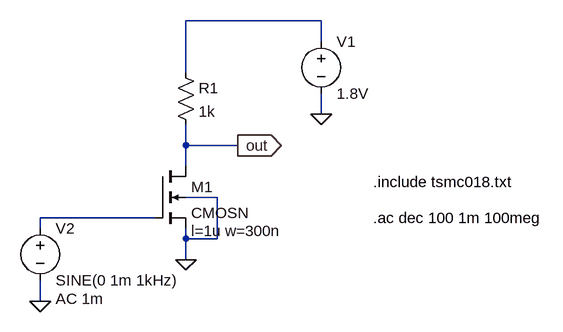
[diagram p0: schematic NMOS.asc]
NMOS.asc, the LTspice schematic file:
Version 4
SHEET 1 880 680
WIRE 464 -128 256 -128
WIRE 464 -96 464 -128
WIRE 256 -48 256 -128
WIRE 464 16 464 -16
WIRE 256 64 256 32
WIRE 336 64 256 64
WIRE 256 96 256 64
WIRE 304 144 256 144
WIRE 208 176 32 176
WIRE 32 192 32 176
WIRE 256 208 256 192
WIRE 304 208 304 144
WIRE 304 208 256 208
WIRE 256 240 256 208
WIRE 32 304 32 272
FLAG 256 240 0
FLAG 464 16 0
FLAG 32 304 0
FLAG 336 64 out
IOPIN 336 64 Out
SYMBOL nmos4 208 96 R0
WINDOW 123 56 100 Left 2
SYMATTR Value2 l=1u w=300n
SYMATTR InstName M1
SYMATTR Value CMOSN
SYMBOL voltage 464 -112 R0
WINDOW 123 0 0 Left 0
WINDOW 39 0 0 Left 0
SYMATTR InstName V1
SYMATTR Value 1.8V
SYMBOL voltage 32 176 R0
WINDOW 123 24 124 Left 2
WINDOW 39 0 0 Left 0
SYMATTR Value2 AC 1m
SYMATTR InstName V2
SYMATTR Value SINE(0 1m 1kHz)
SYMBOL res 240 -64 R0
SYMATTR InstName R1
SYMATTR Value 1k
TEXT 544 120 Left 2 !.include tsmc018.txt
TEXT 544 176 Left 2 !.ac dec 100 1m 100meg

The netlist it stands for:
* NMOS.asc
M1 out N002 0 0 CMOSN l=1u w=300n
V1 N001 0 1.8V
V2 N002 0 SINE(0 1m 1kHz) AC 1m
R1 N001 out 1k
.model NMOS NMOS
.model PMOS PMOS
.lib standard.mos
.include tsmc018.txt
.ac dec 100 1m 100meg
.backanno
.end